# Altium project FIT_PM_Dual_Range_AFE.PrjPcb (part 6 of 8)

## Sheet ADCs.SchDoc: FIT_PM12 board
size 420 x 297 mm; CheckedBy: G.Kasprowicz; Author: INR Moscow; CompanyName: WUT ISE; DrawnBy: M.Podgórski; Organization: WUT ISE; Address1: PW ISE; Address2: Nowowiejska 15/19 00-665 Warsaw; Address3: gkasprow@gmail.com; DocumentNumber: 4; Revision: 2; SheetNumber: 6; SheetTotal: 21; ModifiedBy: -; CheckedDate: -; Title2: ADCs; DivGrp: WUT ISE; Designer: INR RAS; ModifiedDate: -; ProjectName: Sensor Box
Used 2 times, as channels U_AFE/U_ADCs1, U_AFE/U_ADCs2. Parts and nets are listed once, with the designators drawn on the sheet.
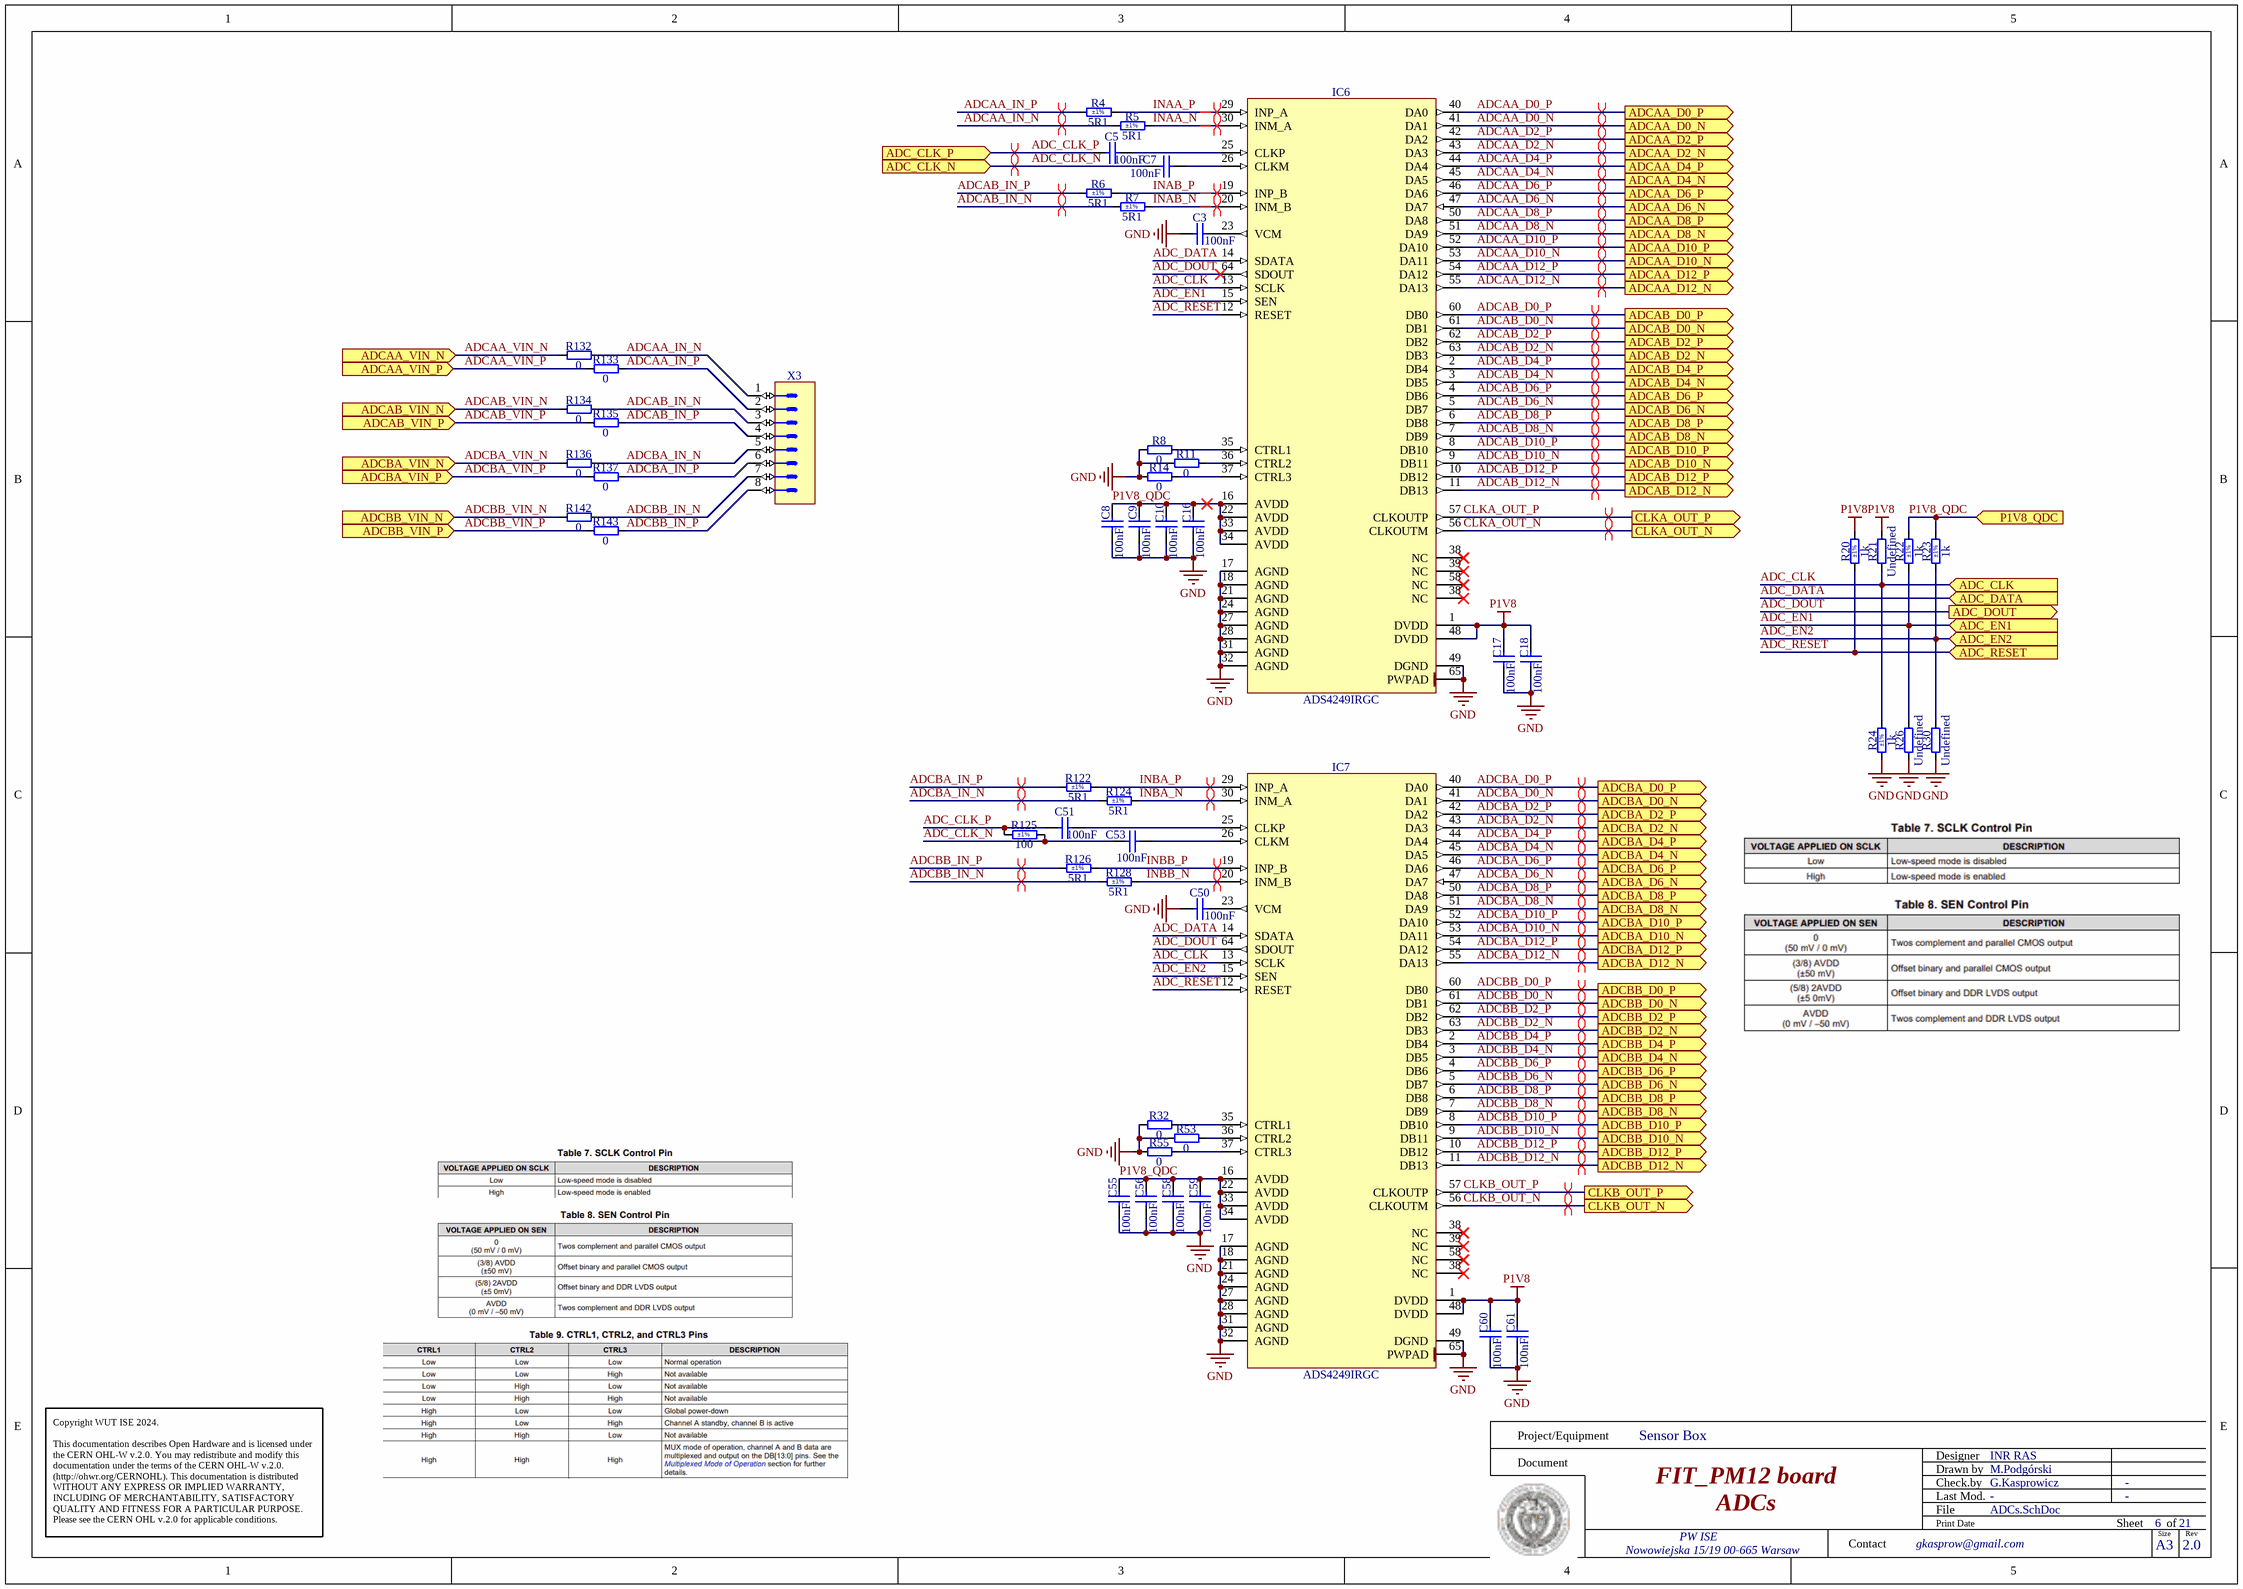
[diagram p17: ADCs.SchDoc]

### Parts
C3  100nF  [CAPC1005X55N]
C5  100nF  [CAPC1005X55N]
C7  100nF  [CAPC1005X55N]
C8  100nF  [CAPC1005X55N]
C9  100nF  [CAPC1005X55N]
C10  100nF  [CAPC1005X55N]
C16  100nF  [CAPC1005X55N]
C17  100nF  [CAPC1005X55N]
C18  100nF  [CAPC1005X55N]
C50  100nF  [CAPC1005X55N]
C51  100nF  [CAPC1005X55N]
C53  100nF  [CAPC1005X55N]
C55  100nF  [CAPC1005X55N]
C56  100nF  [CAPC1005X55N]
C58  100nF  [CAPC1005X55N]
C59  100nF  [CAPC1005X55N]
C60  100nF  [CAPC1005X55N]
C61  100nF  [CAPC1005X55N]
IC6  ADS4249IRGC  [QFN50P900X900X100-65N-S750]
IC7  ADS4249IRGC  [QFN50P900X900X100-65N-S750]
R4  5R1  Tolerance: ±1%  [RESC1005X40N]
R5  5R1  Tolerance: ±1%  [RESC1005X40N]
R6  5R1  Tolerance: ±1%  [RESC1005X40N]
R7  5R1  Tolerance: ±1%  [RESC1005X40N]
R8  0  [RESC1005X40N]
R11  0  [RESC1005X40N]
R14  0  [RESC1005X40N]
R20  1k  Tolerance: ±1%  [RESC1005X40N]
R21  Undefined  [RESC1005X40N]
R22  1k  Tolerance: ±1%  [RESC1005X40N]
R23  1k  Tolerance: ±1%  [RESC1005X40N]
R24  1k  Tolerance: ±1%  [RESC1005X40N]
R26  Undefined  [RESC1005X40N]
R30  Undefined  [RESC1005X40N]
R32  0  [RESC1005X40N]
R53  0  [RESC1005X40N]
R55  0  [RESC1005X40N]
R122  5R1  Tolerance: ±1%  [RESC1005X40N]
R124  5R1  Tolerance: ±1%  [RESC1005X40N]
R125  100  Tolerance: ±1%  [RESC1608X55N]
R126  5R1  Tolerance: ±1%  [RESC1005X40N]
R128  5R1  Tolerance: ±1%  [RESC1005X40N]
R132  0  [RESC1005X40N]
R133  0  [RESC1005X40N]
R134  0  [RESC1005X40N]
R135  0  [RESC1005X40N]
R136  0  [RESC1005X40N]
R137  0  [RESC1005X40N]
R142  0  [RESC1005X40N]
R143  0  [RESC1005X40N]
X3  Header 8  [SAMTEC_DW-08-09-L-S-470]  (value not drawn)

### Ports
ADC_CLK (in), ADC_CLK_N (in), ADC_CLK_P (in), ADC_DATA (in), ADC_DOUT (out), ADC_EN1 (in), ADC_EN2 (in), ADC_RESET (in), ADCAA_D0_N (out), ADCAA_D0_P (out), ADCAA_D2_N (out), ADCAA_D2_P (out), ADCAA_D4_N (out), ADCAA_D4_P (out), ADCAA_D6_N (out), ADCAA_D6_P (out), ADCAA_D8_N (out), ADCAA_D8_P (out), ADCAA_D10_N (out), ADCAA_D10_P (out), ADCAA_D12_N (out), ADCAA_D12_P (out), ADCAA_VIN_N (in), ADCAA_VIN_P (in), ADCAB_D0_N (out), ADCAB_D0_P (out), ADCAB_D2_N (out), ADCAB_D2_P (out), ADCAB_D4_N (out), ADCAB_D4_P (out), ADCAB_D6_N (out), ADCAB_D6_P (out), ADCAB_D8_N (out), ADCAB_D8_P (out), ADCAB_D10_N (out), ADCAB_D10_P (out), ADCAB_D12_N (out), ADCAB_D12_P (out), ADCAB_VIN_N (in), ADCAB_VIN_P (in), ADCBA_D0_N (out), ADCBA_D0_P (out), ADCBA_D2_N (out), ADCBA_D2_P (out), ADCBA_D4_N (out), ADCBA_D4_P (out), ADCBA_D6_N (out), ADCBA_D6_P (out), ADCBA_D8_N (out), ADCBA_D8_P (out), ADCBA_D10_N (out), ADCBA_D10_P (out), ADCBA_D12_N (out), ADCBA_D12_P (out), ADCBA_VIN_N (in), ADCBA_VIN_P (in), ADCBB_D0_N (out), ADCBB_D0_P (out), ADCBB_D2_N (out), ADCBB_D2_P (out), ADCBB_D4_N (out), ADCBB_D4_P (out), ADCBB_D6_N (out), ADCBB_D6_P (out), ADCBB_D8_N (out), ADCBB_D8_P (out), ADCBB_D10_N (out), ADCBB_D10_P (out), ADCBB_D12_N (out), ADCBB_D12_P (out), ADCBB_VIN_N (in), ADCBB_VIN_P (in), CLKA_OUT_N (out), CLKA_OUT_P (out), CLKB_OUT_N (out), CLKB_OUT_P (out), P1V8_QDC (in)

### Nets
GND: C3.1 C8.1 C9.1 C10.1 C16.1 C17.1 C18.1 C50.1 C55.1 C56.1 C58.1 C59.1 C60.1 C61.1 IC6.17(AGND) IC6.18(AGND) IC6.21(AGND) IC6.24(AGND) IC6.27(AGND) IC6.28(AGND) IC6.31(AGND) IC6.32(AGND) IC6.49(DGND) IC6.65(PWPAD) IC7.17(AGND) IC7.18(AGND) IC7.21(AGND) IC7.24(AGND) IC7.27(AGND) IC7.28(AGND) IC7.31(AGND) IC7.32(AGND) IC7.49(DGND) IC7.65(PWPAD) R8.1 R11.1 R14.1 R24.1 R26.1 R30.1 R32.1 R53.1 R55.1
P1V8: C17.2 C18.2 C60.2 C61.2 IC6.1(DVDD) IC6.48(DVDD) IC7.1(DVDD) IC7.48(DVDD) R20.2 R21.2
ADC_CLK: IC6.13(SCLK) IC7.13(SCLK) R21.1 R24.2 ; port ADC_CLK
ADC_CLK_N: C7.1 C53.1 R125.2 ; port ADC_CLK_N
ADC_CLK_P: C5.1 C51.1 R125.1 ; port ADC_CLK_P
ADC_DATA: IC6.14(SDATA) IC7.14(SDATA) ; port ADC_DATA
ADC_DOUT: IC6.64(SDOUT) IC7.64(SDOUT) ; port ADC_DOUT
ADC_EN1: IC6.15(SEN) R22.1 R26.2 ; port ADC_EN1
ADC_EN2: IC7.15(SEN) R23.1 R30.2 ; port ADC_EN2
ADC_RESET: IC6.12(RESET) IC7.12(RESET) R20.1 ; port ADC_RESET
ADCAA_D0_N: IC6.41(DA1) ; port ADCAA_D0_N
ADCAA_D0_P: IC6.40(DA0) ; port ADCAA_D0_P
ADCAA_D2_N: IC6.43(DA3) ; port ADCAA_D2_N
ADCAA_D2_P: IC6.42(DA2) ; port ADCAA_D2_P
ADCAA_D4_N: IC6.45(DA5) ; port ADCAA_D4_N
ADCAA_D4_P: IC6.44(DA4) ; port ADCAA_D4_P
ADCAA_D6_N: IC6.47(DA7) ; port ADCAA_D6_N
ADCAA_D6_P: IC6.46(DA6) ; port ADCAA_D6_P
ADCAA_D8_N: IC6.51(DA9) ; port ADCAA_D8_N
ADCAA_D8_P: IC6.50(DA8) ; port ADCAA_D8_P
ADCAA_D10_N: IC6.53(DA11) ; port ADCAA_D10_N
ADCAA_D10_P: IC6.52(DA10) ; port ADCAA_D10_P
ADCAA_D12_N: IC6.55(DA13) ; port ADCAA_D12_N
ADCAA_D12_P: IC6.54(DA12) ; port ADCAA_D12_P
ADCAA_IN_N: R5.1 R132.2 X3.1
ADCAA_IN_P: R4.1 R133.2 X3.2
ADCAA_VIN_N: R132.1 ; port ADCAA_VIN_N
ADCAA_VIN_P: R133.1 ; port ADCAA_VIN_P
ADCAB_D0_N: IC6.61(DB1) ; port ADCAB_D0_N
ADCAB_D0_P: IC6.60(DB0) ; port ADCAB_D0_P
ADCAB_D2_N: IC6.63(DB3) ; port ADCAB_D2_N
ADCAB_D2_P: IC6.62(DB2) ; port ADCAB_D2_P
ADCAB_D4_N: IC6.3(DB5) ; port ADCAB_D4_N
ADCAB_D4_P: IC6.2(DB4) ; port ADCAB_D4_P
ADCAB_D6_N: IC6.5(DB7) ; port ADCAB_D6_N
ADCAB_D6_P: IC6.4(DB6) ; port ADCAB_D6_P
ADCAB_D8_N: IC6.7(DB9) ; port ADCAB_D8_N
ADCAB_D8_P: IC6.6(DB8) ; port ADCAB_D8_P
ADCAB_D10_N: IC6.9(DB11) ; port ADCAB_D10_N
ADCAB_D10_P: IC6.8(DB10) ; port ADCAB_D10_P
ADCAB_D12_N: IC6.11(DB13) ; port ADCAB_D12_N
ADCAB_D12_P: IC6.10(DB12) ; port ADCAB_D12_P
ADCAB_IN_N: R7.1 R134.2 X3.3
ADCAB_IN_P: R6.1 R135.2 X3.4
ADCAB_VIN_N: R134.1 ; port ADCAB_VIN_N
ADCAB_VIN_P: R135.1 ; port ADCAB_VIN_P
ADCBA_D0_N: IC7.41(DA1) ; port ADCBA_D0_N
ADCBA_D0_P: IC7.40(DA0) ; port ADCBA_D0_P
ADCBA_D2_N: IC7.43(DA3) ; port ADCBA_D2_N
ADCBA_D2_P: IC7.42(DA2) ; port ADCBA_D2_P
ADCBA_D4_N: IC7.45(DA5) ; port ADCBA_D4_N
ADCBA_D4_P: IC7.44(DA4) ; port ADCBA_D4_P
ADCBA_D6_N: IC7.47(DA7) ; port ADCBA_D6_N
ADCBA_D6_P: IC7.46(DA6) ; port ADCBA_D6_P
ADCBA_D8_N: IC7.51(DA9) ; port ADCBA_D8_N
ADCBA_D8_P: IC7.50(DA8) ; port ADCBA_D8_P
ADCBA_D10_N: IC7.53(DA11) ; port ADCBA_D10_N
ADCBA_D10_P: IC7.52(DA10) ; port ADCBA_D10_P
ADCBA_D12_N: IC7.55(DA13) ; port ADCBA_D12_N
ADCBA_D12_P: IC7.54(DA12) ; port ADCBA_D12_P
ADCBA_IN_N: R124.1 R136.2 X3.5
ADCBA_IN_P: R122.1 R137.2 X3.6
ADCBA_VIN_N: R136.1 ; port ADCBA_VIN_N
ADCBA_VIN_P: R137.1 ; port ADCBA_VIN_P
ADCBB_D0_N: IC7.61(DB1) ; port ADCBB_D0_N
ADCBB_D0_P: IC7.60(DB0) ; port ADCBB_D0_P
ADCBB_D2_N: IC7.63(DB3) ; port ADCBB_D2_N
ADCBB_D2_P: IC7.62(DB2) ; port ADCBB_D2_P
ADCBB_D4_N: IC7.3(DB5) ; port ADCBB_D4_N
ADCBB_D4_P: IC7.2(DB4) ; port ADCBB_D4_P
ADCBB_D6_N: IC7.5(DB7) ; port ADCBB_D6_N
ADCBB_D6_P: IC7.4(DB6) ; port ADCBB_D6_P
ADCBB_D8_N: IC7.7(DB9) ; port ADCBB_D8_N
ADCBB_D8_P: IC7.6(DB8) ; port ADCBB_D8_P
ADCBB_D10_N: IC7.9(DB11) ; port ADCBB_D10_N
ADCBB_D10_P: IC7.8(DB10) ; port ADCBB_D10_P
ADCBB_D12_N: IC7.11(DB13) ; port ADCBB_D12_N
ADCBB_D12_P: IC7.10(DB12) ; port ADCBB_D12_P
ADCBB_IN_N: R128.1 R142.2 X3.7
ADCBB_IN_P: R126.1 R143.2 X3.8
ADCBB_VIN_N: R142.1 ; port ADCBB_VIN_N
ADCBB_VIN_P: R143.1 ; port ADCBB_VIN_P
CLKA_OUT_N: IC6.56(CLKOUTM) ; port CLKA_OUT_N
CLKA_OUT_P: IC6.57(CLKOUTP) ; port CLKA_OUT_P
CLKB_OUT_N: IC7.56(CLKOUTM) ; port CLKB_OUT_N
CLKB_OUT_P: IC7.57(CLKOUTP) ; port CLKB_OUT_P
INAA_N: IC6.30(INM_A) R5.2
INAA_P: IC6.29(INP_A) R4.2
INAB_N: IC6.20(INM_B) R7.2
INAB_P: IC6.19(INP_B) R6.2
INBA_N: IC7.30(INM_A) R124.2
INBA_P: IC7.29(INP_A) R122.2
INBB_N: IC7.20(INM_B) R128.2
INBB_P: IC7.19(INP_B) R126.2
P1V8_QDC: C8.2 C9.2 C10.2 C16.2 C55.2 C56.2 C58.2 C59.2 IC6.16(AVDD) IC6.22(AVDD) IC6.33(AVDD) IC6.34(AVDD) IC7.16(AVDD) IC7.22(AVDD) IC7.33(AVDD) IC7.34(AVDD) R22.2 R23.2 ; port P1V8_QDC
NetC3_2: C3.2 IC6.23(VCM)
NetC5_2: C5.2 IC6.25(CLKP)
NetC7_2: C7.2 IC6.26(CLKM)
NetC50_2: C50.2 IC7.23(VCM)
NetC51_2: C51.2 IC7.25(CLKP)
NetC53_2: C53.2 IC7.26(CLKM)
NetIC6_35: IC6.35(CTRL1) R8.2
NetIC6_36: IC6.36(CTRL2) R11.2
NetIC6_37: IC6.37(CTRL3) R14.2
NetIC7_35: IC7.35(CTRL1) R32.2
NetIC7_36: IC7.36(CTRL2) R53.2
NetIC7_37: IC7.37(CTRL3) R55.2

Not connected (* = marked no-connect by the designer): IC6 38(NC)* 39(NC)* 58(NC)*; IC7 38(NC)* 39(NC)* 58(NC)*

### Channels
U_AFE/U_ADCs1: designators C3=C3A C5=C5A C7=C7A C8=C8A C9=C9A C10=C10A C16=C16A C17=C17A C18=C18A C50=C50A C51=C51A C53=C53A C55=C55A C56=C56A C58=C58A C59=C59A C60=C60A C61=C61A IC6=IC6A IC7=IC7A R4=R4A R5=R5A R6=R6A R7=R7A R8=R8A R11=R15A R14=R14A R20=R20A R21=R21A R22=R22A R23=R23A R24=R24A R26=R26A R30=R30A R32=R32A R53=R53A R55=R55A R122=R122A R124=R124A R125=R125A R126=R126A R128=R128A R132=R132A R133=R133A R134=R134A R135=R135A R136=R136A R137=R137A R142=R142A R143=R143A X3=X3A; ports ADC_CLK=ADC_CLK_U_ADCs1 ADC_CLK_N=ADC_CLK_N ADC_CLK_P=ADC_CLK_P ADC_DATA=ADC_DATA_U_ADCs1 ADC_DOUT=ADC_DOUT_U_ADCs1 ADC_EN1=ADC_EN1_U_ADCs1 ADC_EN2=ADC_EN2_U_ADCs1 ADC_RESET=ADC_RESET_U_ADCs1 ADCAA_D0_N=ADCAA_D0_N_U_ADCs1 ADCAA_D0_P=ADCAA_D0_P_U_ADCs1 ADCAA_D2_N=ADCAA_D2_N_U_ADCs1 ADCAA_D2_P=ADCAA_D2_P_U_ADCs1 ADCAA_D4_N=ADCAA_D4_N_U_ADCs1 ADCAA_D4_P=ADCAA_D4_P_U_ADCs1 ADCAA_D6_N=ADCAA_D6_N_U_ADCs1 ADCAA_D6_P=ADCAA_D6_P_U_ADCs1 ADCAA_D8_N=ADCAA_D8_N_U_ADCs1 ADCAA_D8_P=ADCAA_D8_P_U_ADCs1 ADCAA_D10_N=ADCAA_D10_N_U_ADCs1 ADCAA_D10_P=ADCAA_D10_P_U_ADCs1 ADCAA_D12_N=ADCAA_D12_N_U_ADCs1 ADCAA_D12_P=ADCAA_D12_P_U_ADCs1 ADCAA_VIN_N=ADCAA_VIN_N ADCAA_VIN_P=ADCAA_VIN_P ADCAB_D0_N=ADCAB_D0_N_U_ADCs1 ADCAB_D0_P=ADCAB_D0_P_U_ADCs1 ADCAB_D2_N=ADCAB_D2_N_U_ADCs1 ADCAB_D2_P=ADCAB_D2_P_U_ADCs1 ADCAB_D4_N=ADCAB_D4_N_U_ADCs1 ADCAB_D4_P=ADCAB_D4_P_U_ADCs1 ADCAB_D6_N=ADCAB_D6_N_U_ADCs1 ADCAB_D6_P=ADCAB_D6_P_U_ADCs1 ADCAB_D8_N=ADCAB_D8_N_U_ADCs1 ADCAB_D8_P=ADCAB_D8_P_U_ADCs1 ADCAB_D10_N=ADCAB_D10_N_U_ADCs1 ADCAB_D10_P=ADCAB_D10_P_U_ADCs1 ADCAB_D12_N=ADCAB_D12_N_U_ADCs1 ADCAB_D12_P=ADCAB_D12_P_U_ADCs1 ADCAB_VIN_N=ADCAB_VIN_N ADCAB_VIN_P=ADCAB_VIN_P ADCBA_D0_N=ADCBA_D0_N_U_ADCs1 ADCBA_D0_P=ADCBA_D0_P_U_ADCs1 ADCBA_D2_N=ADCBA_D2_N_U_ADCs1 ADCBA_D2_P=ADCBA_D2_P_U_ADCs1 ADCBA_D4_N=ADCBA_D4_N_U_ADCs1 ADCBA_D4_P=ADCBA_D4_P_U_ADCs1 ADCBA_D6_N=ADCBA_D6_N_U_ADCs1 ADCBA_D6_P=ADCBA_D6_P_U_ADCs1 ADCBA_D8_N=ADCBA_D8_N_U_ADCs1 ADCBA_D8_P=ADCBA_D8_P_U_ADCs1 ADCBA_D10_N=ADCBA_D10_N_U_ADCs1 ADCBA_D10_P=ADCBA_D10_P_U_ADCs1 ADCBA_D12_N=ADCBA_D12_N_U_ADCs1 ADCBA_D12_P=ADCBA_D12_P_U_ADCs1 ADCBA_VIN_N=ADCBA_VIN_N ADCBA_VIN_P=ADCBA_VIN_P ADCBB_D0_N=ADCBB_D0_N_U_ADCs1 ADCBB_D0_P=ADCBB_D0_P_U_ADCs1 ADCBB_D2_N=ADCBB_D2_N_U_ADCs1 ADCBB_D2_P=ADCBB_D2_P_U_ADCs1 ADCBB_D4_N=ADCBB_D4_N_U_ADCs1 ADCBB_D4_P=ADCBB_D4_P_U_ADCs1 ADCBB_D6_N=ADCBB_D6_N_U_ADCs1 ADCBB_D6_P=ADCBB_D6_P_U_ADCs1 ADCBB_D8_N=ADCBB_D8_N_U_ADCs1 ADCBB_D8_P=ADCBB_D8_P_U_ADCs1 ADCBB_D10_N=ADCBB_D10_N_U_ADCs1 ADCBB_D10_P=ADCBB_D10_P_U_ADCs1 ADCBB_D12_N=ADCBB_D12_N_U_ADCs1 ADCBB_D12_P=ADCBB_D12_P_U_ADCs1 ADCBB_VIN_N=ADCBB_VIN_N ADCBB_VIN_P=ADCBB_VIN_P CLKA_OUT_N=CLKA_OUT_N_U_ADCs1 CLKA_OUT_P=CLKA_OUT_P_U_ADCs1 CLKB_OUT_N=CLKB_OUT_N_U_ADCs1 CLKB_OUT_P=CLKB_OUT_P_U_ADCs1 P1V8_QDC=P1V8_QDC
U_AFE/U_ADCs2: designators C3=C3B C5=C5B C7=C7B C8=C8B C9=C9B C10=C10B C16=C16B C17=C17B C18=C18B C50=C50B C51=C51B C53=C53B C55=C55B C56=C56B C58=C58B C59=C59B C60=C60B C61=C61B IC6=IC6B IC7=IC7B R4=R4B R5=R5B R6=R6B R7=R7B R8=R8B R11=R15B R14=R14B R20=R20B R21=R21B R22=R22B R23=R23B R24=R24B R26=R26B R30=R30B R32=R32B R53=R53B R55=R55B R122=R122B R124=R124B R125=R125B R126=R126B R128=R128B R132=R132B R133=R133B R134=R134B R135=R135B R136=R136B R137=R137B R142=R142B R143=R143B X3=X3B; ports ADC_CLK=ADC_CLK_U_ADCs2 ADC_CLK_N=ADC_CLK_N ADC_CLK_P=ADC_CLK_P ADC_DATA=ADC_DATA_U_ADCs2 ADC_DOUT=ADC_DOUT_U_ADCs2 ADC_EN1=ADC_EN1_U_ADCs2 ADC_EN2=ADC_EN2_U_ADCs2 ADC_RESET=ADC_RESET_U_ADCs2 ADCAA_D0_N=ADCAA_D0_N_U_ADCs2 ADCAA_D0_P=ADCAA_D0_P_U_ADCs2 ADCAA_D2_N=ADCAA_D2_N_U_ADCs2 ADCAA_D2_P=ADCAA_D2_P_U_ADCs2 ADCAA_D4_N=ADCAA_D4_N_U_ADCs2 ADCAA_D4_P=ADCAA_D4_P_U_ADCs2 ADCAA_D6_N=ADCAA_D6_N_U_ADCs2 ADCAA_D6_P=ADCAA_D6_P_U_ADCs2 ADCAA_D8_N=ADCAA_D8_N_U_ADCs2 ADCAA_D8_P=ADCAA_D8_P_U_ADCs2 ADCAA_D10_N=ADCAA_D10_N_U_ADCs2 ADCAA_D10_P=ADCAA_D10_P_U_ADCs2 ADCAA_D12_N=ADCAA_D12_N_U_ADCs2 ADCAA_D12_P=ADCAA_D12_P_U_ADCs2 ADCAA_VIN_N=ADCAA_VIN_N ADCAA_VIN_P=ADCAA_VIN_P ADCAB_D0_N=ADCAB_D0_N_U_ADCs2 ADCAB_D0_P=ADCAB_D0_P_U_ADCs2 ADCAB_D2_N=ADCAB_D2_N_U_ADCs2 ADCAB_D2_P=ADCAB_D2_P_U_ADCs2 ADCAB_D4_N=ADCAB_D4_N_U_ADCs2 ADCAB_D4_P=ADCAB_D4_P_U_ADCs2 ADCAB_D6_N=ADCAB_D6_N_U_ADCs2 ADCAB_D6_P=ADCAB_D6_P_U_ADCs2 ADCAB_D8_N=ADCAB_D8_N_U_ADCs2 ADCAB_D8_P=ADCAB_D8_P_U_ADCs2 ADCAB_D10_N=ADCAB_D10_N_U_ADCs2 ADCAB_D10_P=ADCAB_D10_P_U_ADCs2 ADCAB_D12_N=ADCAB_D12_N_U_ADCs2 ADCAB_D12_P=ADCAB_D12_P_U_ADCs2 ADCAB_VIN_N=ADCAB_VIN_N ADCAB_VIN_P=ADCAB_VIN_P ADCBA_D0_N=ADCBA_D0_N_U_ADCs2 ADCBA_D0_P=ADCBA_D0_P_U_ADCs2 ADCBA_D2_N=ADCBA_D2_N_U_ADCs2 ADCBA_D2_P=ADCBA_D2_P_U_ADCs2 ADCBA_D4_N=ADCBA_D4_N_U_ADCs2 ADCBA_D4_P=ADCBA_D4_P_U_ADCs2 ADCBA_D6_N=ADCBA_D6_N_U_ADCs2 ADCBA_D6_P=ADCBA_D6_P_U_ADCs2 ADCBA_D8_N=ADCBA_D8_N_U_ADCs2 ADCBA_D8_P=ADCBA_D8_P_U_ADCs2 ADCBA_D10_N=ADCBA_D10_N_U_ADCs2 ADCBA_D10_P=ADCBA_D10_P_U_ADCs2 ADCBA_D12_N=ADCBA_D12_N_U_ADCs2 ADCBA_D12_P=ADCBA_D12_P_U_ADCs2 ADCBA_VIN_N=ADCBA_VIN_N ADCBA_VIN_P=ADCBA_VIN_P ADCBB_D0_N=ADCBB_D0_N_U_ADCs2 ADCBB_D0_P=ADCBB_D0_P_U_ADCs2 ADCBB_D2_N=ADCBB_D2_N_U_ADCs2 ADCBB_D2_P=ADCBB_D2_P_U_ADCs2 ADCBB_D4_N=ADCBB_D4_N_U_ADCs2 ADCBB_D4_P=ADCBB_D4_P_U_ADCs2 ADCBB_D6_N=ADCBB_D6_N_U_ADCs2 ADCBB_D6_P=ADCBB_D6_P_U_ADCs2 ADCBB_D8_N=ADCBB_D8_N_U_ADCs2 ADCBB_D8_P=ADCBB_D8_P_U_ADCs2 ADCBB_D10_N=ADCBB_D10_N_U_ADCs2 ADCBB_D10_P=ADCBB_D10_P_U_ADCs2 ADCBB_D12_N=ADCBB_D12_N_U_ADCs2 ADCBB_D12_P=ADCBB_D12_P_U_ADCs2 ADCBB_VIN_N=ADCBB_VIN_N ADCBB_VIN_P=ADCBB_VIN_P CLKA_OUT_N=CLKA_OUT_N_U_ADCs2 CLKA_OUT_P=CLKA_OUT_P_U_ADCs2 CLKB_OUT_N=CLKB_OUT_N_U_ADCs2 CLKB_OUT_P=CLKB_OUT_P_U_ADCs2 P1V8_QDC=P1V8_QDC

### Layout directives
differential pair; differential pair class D100: ADC_CLK_N, ADC_CLK_P, ADCAA_D0_N_U_ADCs1, ADCAA_D0_P_U_ADCs1, ADCAA_D2_N_U_ADCs1, ADCAA_D2_P_U_ADCs1, ADCAA_D4_N_U_ADCs1, ADCAA_D4_P_U_ADCs1, ADCAA_D6_N_U_ADCs1, ADCAA_D6_P_U_ADCs1, ADCAA_D8_N_U_ADCs1, ADCAA_D8_P_U_ADCs1, ADCAA_D10_N_U_ADCs1, ADCAA_D10_P_U_ADCs1, ADCAA_D12_N_U_ADCs1, ADCAA_D12_P_U_ADCs1, ADCAA_IN_N_U_ADCs1, ADCAA_IN_P_U_ADCs1, ADCAB_D0_N_U_ADCs1, ADCAB_D0_P_U_ADCs1, ADCAB_D2_N_U_ADCs1, ADCAB_D2_P_U_ADCs1, ADCAB_D4_N_U_ADCs1, ADCAB_D4_P_U_ADCs1, ADCAB_D6_N_U_ADCs1, ADCAB_D6_P_U_ADCs1, ADCAB_D8_N_U_ADCs1, ADCAB_D8_P_U_ADCs1, ADCAB_D10_N_U_ADCs1, ADCAB_D10_P_U_ADCs1, ADCAB_D12_N_U_ADCs1, ADCAB_D12_P_U_ADCs1, ADCAB_IN_N_U_ADCs1, ADCAB_IN_P_U_ADCs1, ADCBA_D0_N_U_ADCs1, ADCBA_D0_P_U_ADCs1, ADCBA_D2_N_U_ADCs1, ADCBA_D2_P_U_ADCs1, ADCBA_D4_N_U_ADCs1, ADCBA_D4_P_U_ADCs1, ADCBA_D6_N_U_ADCs1, ADCBA_D6_P_U_ADCs1, ADCBA_D8_N_U_ADCs1, ADCBA_D8_P_U_ADCs1, ADCBA_D10_N_U_ADCs1, ADCBA_D10_P_U_ADCs1, ADCBA_D12_N_U_ADCs1, ADCBA_D12_P_U_ADCs1, ADCBA_IN_N_U_ADCs1, ADCBA_IN_P_U_ADCs1, ADCBB_D0_N_U_ADCs1, ADCBB_D0_P_U_ADCs1, ADCBB_D2_N_U_ADCs1, ADCBB_D2_P_U_ADCs1, ADCBB_D4_N_U_ADCs1, ADCBB_D4_P_U_ADCs1, ADCBB_D6_N_U_ADCs1, ADCBB_D6_P_U_ADCs1, ADCBB_D8_N_U_ADCs1, ADCBB_D8_P_U_ADCs1, ADCBB_D10_N_U_ADCs1, ADCBB_D10_P_U_ADCs1, ADCBB_D12_N_U_ADCs1, ADCBB_D12_P_U_ADCs1, ADCBB_IN_N_U_ADCs1, ADCBB_IN_P_U_ADCs1, CLKA_OUT_N_U_ADCs1, CLKA_OUT_P_U_ADCs1, CLKB_OUT_N_U_ADCs1, CLKB_OUT_P_U_ADCs1, INAA_N_U_ADCs1, INAA_P_U_ADCs1, INAB_N_U_ADCs1, INAB_P_U_ADCs1, INBA_N_U_ADCs1, INBA_P_U_ADCs1, INBB_N_U_ADCs1, INBB_P_U_ADCs1

### Notes on the sheet
- Project/Equipment
- Document
- Designer
- Drawn by
- Check.by
- Copyright WUT ISE 2024.
  This documentation describes Open Hardware and is licensed under the CERN OHL-W v.2.0. You may redistribute and modify this documentation under the terms of the CERN OHL-W v.2.0. (http://ohwr.org/CERNOHL). This documentation is distributed WITHOUT ANY EXPRESS OR IMPLIED WARRANTY, INCLUDING OF MERCHANTABILITY, SATISFACTORY QUALITY AND FITNESS FOR A PARTICULAR PURPOSE. Please see the CERN OHL v.2.0 for applicable conditions.
- Contact
- File
- Last Mod.
- Print Date
- Sheet
- Size
- A3
- of
- Rev

### Library data of the parts
C3 C5 C7-C10 C16-C18 C50 C51 C53 C55 C56 C58-C61 = CC0402_100NF_16V_10%_X5R: Non-polarised capacitor; Part Description: SMD Multilayer Chip Ceramic Capacitor; Manufacturer: GENERIC; Manufacturer1 Part Number: GRM155R61C104KA88D; Voltage: 16V; TC: X5R; Tolerance: ±10%; Part Number: CC0402_100NF_16V_10%_X5R; Component Kind: Standard; Component Type: Standard; Pin Count: 2; Value: 100nF; Status: None; Manufacturer Part Number: CC0402_100NF_16V_10%_X5R; Case: 0402; Mounted: Yes; Socket: No; SMD: Yes; Sense: No; Manufacturer1 Example: MURATA; Manufacturer1 ComponentHeight: 0.55mm; HelpURL: \\cern.ch\dfs\Applications\Altium\Datasheets\CC0402_X5R_MURATA_GRM.pdf; Author: CERN DEM JLC; CreateDate: 10.12.2013; LatestRevisionDate: 10.12.2013
IC6 IC7 = ADS4249IRGC: 16-Bit, 200-MSPS Analog-to-Digital Converters; Part Description: Dual-Channel, 14-Bit, 250-MSPS Ultralow-Power ADC; Manufacturer: TEXAS INSTRUMENTS; PressFit: No; Bonding: No; Part Number: ADS4249IRGC; Component Kind: Standard; Component Type: Standard; Device: ADS4249IRGC; PackageDescription: QFN, 0.50mm Pitch, Square; 64 Pin, 9.00mm L X 9.00mm W X 1.00mm H body (w/Thermal Tab 7.5 X 7.5mm), IPC Medium Density; Manufacturer Part Number: ADS4249IRGC; Pin Count: 65; Case: QFN64; Mounted: Yes; Socket: No; SMD: Yes; Sense: No; ComponentHeight: 1mm; Author: CERN DEM HF; HelpURL: \\cern.ch\dfs\Applications\Altium\Datasheets\ADS4249IRGC.pdf; CreateDate: 05.12.2024; LatestRevisionDate: 05.12.2024
R4-R7 R122 R124 R126 R128 = R0402_5R1_1%_0.0625W_100PPM: Resistor - 1%; Part Description: General Purpose Thick Film Chip Resistor; Manufacturer: GENERIC; Manufacturer1 Part Number: CRCW04025R10FK; TC: ±100ppm/°C; PressFit: No; Part Number: R0402_5R1_1%_0.0625W_100PPM; Component Kind: Standard; Component Type: Standard; Pin Count: 2; Value: 5R1; Status: Not Recommended; Power: 0.0625W; Manufacturer Part Number: R0402_5R1_1%_0.0625W_100PPM; Case: 0402; Mounted: Yes; Sense: No; Socket: No; SMD: Yes; Manufacturer1 Example: VISHAY; Manufacturer1 ComponentHeight: 0.4mm; HelpURL: \\cern.ch\dfs\Applications\Altium\Datasheets\R0402_VISHAY_CRCW e3.pdf; Author: CERN DEM MR; CreateDate: 22.11.2016; LatestRevisionDate: 22.11.2016
R8 R11 R14 R32 R53 R55 R132-R137 R142 R143 = R0402_0R_JUMPER: Resistor; Part Description: 1A (0.05R Max DC Resistance) Zero Ohm Jumper; Manufacturer: GENERIC; Manufacturer1 Part Number: 232270591001L; PressFit: No; Part Number: R0402_0R_JUMPER; Component Kind: Standard; Component Type: Standard; Pin Count: 2; Value: 0; Status: Not Recommended; Manufacturer Part Number: R0402_0R_JUMPER; Case: 0402; Mounted: Yes; Sense: No; Socket: No; SMD: Yes; Manufacturer1 Example: YAGEO PHYCOMP; Manufacturer1 ComponentHeight: 0.4mm; HelpURL: \\cern.ch\dfs\Applications\Altium\Datasheets\R0402_Phycomp_RC0402.pdf; Author: CERN DEM JLC; CreateDate: 03.12.2007; LatestRevisionDate: 17.10.2012
R20 R22-R24 = R0402_1K_1%_0.0625W_100PPM: Resistor - 1%; Part Description: General Purpose Thick Film Chip Resistor; Manufacturer: GENERIC; Manufacturer1 Part Number: 232270671002L; TC: ±100ppm/°C; PressFit: No; Part Number: R0402_1K_1%_0.0625W_100PPM; Component Kind: Standard; Component Type: Standard; Pin Count: 2; Value: 1k; Status: Not Recommended; Power: 0.0625W; Manufacturer Part Number: R0402_1K_1%_0.0625W_100PPM; Case: 0402; Mounted: Yes; Sense: No; Socket: No; SMD: Yes; Manufacturer1 Example: YAGEO PHYCOMP; Manufacturer1 ComponentHeight: 0.4mm; HelpURL: \\cern.ch\dfs\Applications\Altium\Datasheets\R0402_Phycomp_RC0402.pdf; Author: CERN DEM JLC; CreateDate: 03.12.2007; LatestRevisionDate: 17.10.2012
R21 R26 R30 = R0402_NO-VALUE: Resistor; Part Description: Reserved Footprint For a 0402 (1005) Chip Resistor; PressFit: No; Mounted: No; Part Number: R0402_NO-VALUE; Component Kind: Standard; Component Type: Standard; Pin Count: 2; Value: Undefined; Status: None; Manufacturer: Undefined; Manufacturer Part Number: R0402_NO-VALUE; Case: 0402; Sense: No; Socket: No; SMD: Yes; Manufacturer1 Example: Undefined; Manufacturer1 Part Number: Undefined; Manufacturer1 ComponentHeight: Undefined; HelpURL: Undefined; Author: CERN DEM JLC; CreateDate: 03.12.2007; LatestRevisionDate: 13.03.2008
R125 = R0603_100R_1%_0.1W_100PPM: Resistor - 1%; Part Description: General Purpose Thick Film Chip Resistor; Manufacturer: GENERIC; Manufacturer1 Part Number: NRC06F4700TRF; Power: 0.1W; TC: ±100ppm/°C; PressFit: No; Part Number: R0603_100R_1%_0.1W_100PPM; Component Kind: Standard; Component Type: Standard; Pin Count: 2; Value: 100; Status: Preferred; Manufacturer Part Number: R0603_100R_1%_0.1W_100PPM; Case: 0603; Mounted: Yes; Sense: No; Socket: No; SMD: Yes; Manufacturer1 Example: NIC COMPONENT; Manufacturer1 ComponentHeight: 0.55mm; HelpURL: \\cern.ch\dfs\Applications\Altium\Datasheets\R0603_NIC_NRC.pdf; Author: CERN DEM JLC; CreateDate: 03.12.2007; LatestRevisionDate: 13.03.2008
X3 = SAMTEC_DW-08-09-L-S-470: as X4 on sheet Gate_Strobe; Part Number: SAMTEC_DW-08-09-L-S-470; Component Kind: Standard; Component Type: Standard; Pin Count: 8; Family: Header 8; Mounted: Yes; Socket: No; SMD: No; Sense: No; Status: None; Manufacturer Part Number: DW-08-09-L-S-470; ComponentHeight: 15.75mm; HelpURL: \\cern.ch\dfs\Applications\Altium\Datasheets\SAMTEC_DW.pdf; Author: CERN DEM HF; CreateDate: 06.06.2024; LatestRevisionDate: 06.06.2024

## Sheet PM12_ATxmega128.SchDoc: FIT_PM12 board
size 420 x 297 mm; CheckedBy: G.Kasprowicz; Author: INR Moscow; CompanyName: WUT ISE; DrawnBy: M.Podgórski; Organization: WUT ISE; Address1: PW ISE; Address2: Nowowiejska 15/19 00-665 Warsaw; Address3: gkasprow@gmail.com; DocumentNumber: 21; Revision: 2; SheetNumber: 21; SheetTotal: 21; ModifiedBy: -; CheckedDate: -; Title2: MCU; DivGrp: WUT ISE; Designer: INR RAS; ModifiedDate: -; ProjectName: Sensor Box
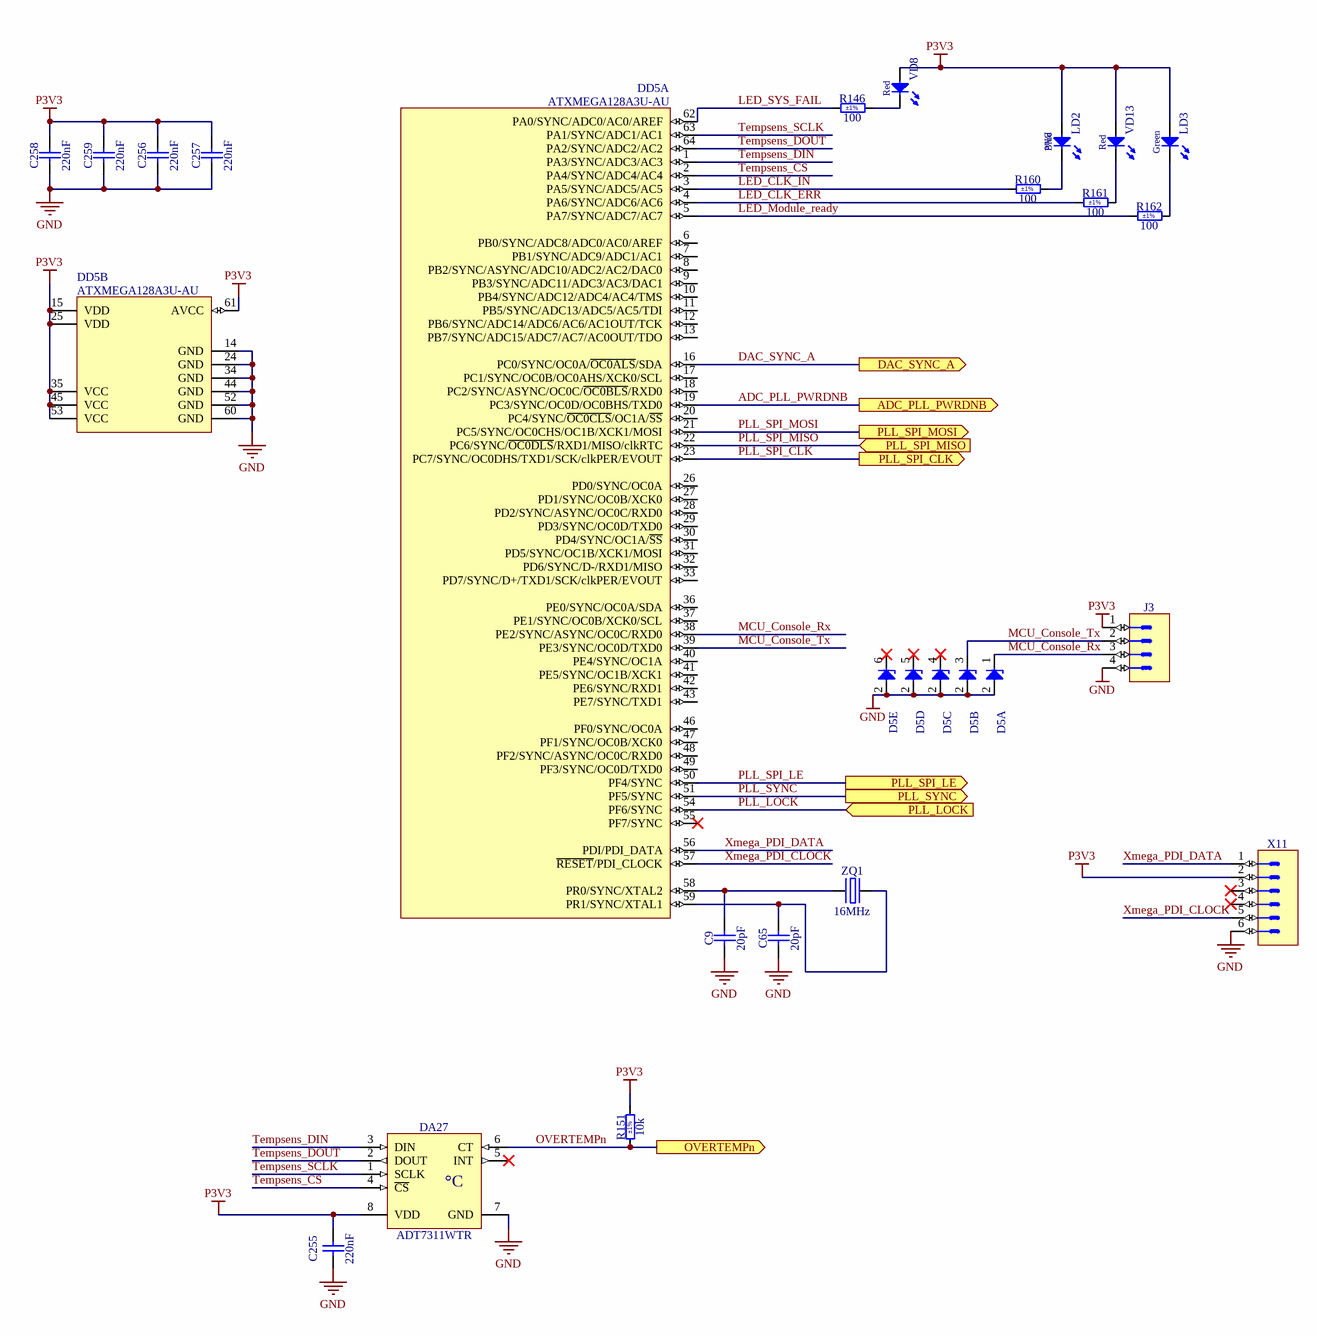
[diagram p18: PM12_ATxmega128.SchDoc]

### Parts
C9  20pF  [CAPC2012X135N]
C65  20pF  [CAPC2012X135N]
C255  220nF  [CAPC2012X135N]
C256  220nF  [CAPC2012X135N]
C257  220nF  [CAPC2012X135N]
C258  220nF  [CAPC2012X135N]
C259  220nF  [CAPC2012X135N]
D5  PESD3V3L5UY  [SOT65P210X110-6N]  (value not drawn)  (parts A,B,C,D,E of 5)
DA27  ADT7311WTR  [SOIC127P600X175-8N]
DD5  ATXMEGA128A3U-AU  [QFP80P1600X1600X120-64N]  (parts A,B of 2)
J3  Header 4  [SAMTEC_TSW-104-07-L-S-LL]  (value not drawn)
LD2  Blue  [LED_OSRAM_LB Q39G]
LD3  Green  [LED_KINGBRIGHT_KPH-1608CGCK]
R146  100  Tolerance: ±1%  [RESC1608X55N]
R151  10k  Tolerance: ±1%  [RESC1608X55N]
R160  100  Tolerance: ±1%  [RESC1608X55N]
R161  100  Tolerance: ±1%  [RESC1608X55N]
R162  100  Tolerance: ±1%  [RESC1608X55N]
VD8  Red  [LED_KINGBRIGHT_KPT-2012SURCK]
VD13  Red  [LED_KINGBRIGHT_KPT-2012SURCK]
X11  (no value)  [CONNFLY_DS1013-06SSIB1-B-0]
ZQ1  16MHz  [XTAL_ABRACON_ABL]

### Ports
ADC_PLL_PWRDNB (out), DAC_SYNC_A (out), OVERTEMPn (out), PLL_LOCK (in), PLL_SPI_CLK (out), PLL_SPI_LE (out), PLL_SPI_MISO (in), PLL_SPI_MOSI (out), PLL_SYNC (out)

### Nets
GND: C9.1 C65.1 C255.1 C256.1 C257.1 C258.1 C259.1 D5.2(A) DA27.7(GND) DD5.14(GND) DD5.24(GND) DD5.34(GND) DD5.44(GND) DD5.52(GND) DD5.60(GND) J3.4 X11.6
P3V3: C255.2 C256.2 C257.2 C258.2 C259.2 DA27.8(VDD) DD5.15(VDD) DD5.25(VDD) DD5.35(VCC) DD5.45(VCC) DD5.53(VCC) DD5.61(AVCC) J3.1 LD2.2(A) LD3.2(A) R151.2 VD8.2(A) VD13.2(A) X11.2
ADC_PLL_PWRDNB: DD5.19(PC3/SYNC/OC0D/OC0BHS/TXD0) ; port ADC_PLL_PWRDNB
DAC_SYNC_A: DD5.16(PC0/SYNC/OC0A/~{OC0ALS}/SDA) ; port DAC_SYNC_A  [project net DAC_SYNC]
LED_CLK_ERR: DD5.4(PA6/SYNC/ADC6/AC6) R161.1
LED_CLK_IN: DD5.3(PA5/SYNC/ADC5/AC5) R160.1
LED_Module_ready: DD5.5(PA7/SYNC/ADC7/AC7) R162.1
LED_SYS_FAIL: DD5.62(PA0/SYNC/ADC0/AC0/AREF) R146.1
MCU_Console_Rx: D5.1(C) DD5.38(PE2/SYNC/ASYNC/OC0C/RXD0) J3.3
MCU_Console_Tx: D5.3(C) DD5.39(PE3/SYNC/OC0D/TXD0) J3.2
OVERTEMPn: DA27.6(CT) R151.1 ; port OVERTEMPn
PLL_LOCK: DD5.54(PF6/SYNC) ; port PLL_LOCK
PLL_SPI_CLK: DD5.23(PC7/SYNC/OC0DHS/TXD1/SCK/clkPER/EVOUT) ; port PLL_SPI_CLK
PLL_SPI_LE: DD5.50(PF4/SYNC) ; port PLL_SPI_LE
PLL_SPI_MISO: DD5.22(PC6/SYNC/~{OC0DLS}/RXD1/MISO/clkRTC) ; port PLL_SPI_MISO
PLL_SPI_MOSI: DD5.21(PC5/SYNC/OC0CHS/OC1B/XCK1/MOSI) ; port PLL_SPI_MOSI
PLL_SYNC: DD5.51(PF5/SYNC) ; port PLL_SYNC
Tempsens_CS: DA27.4(~{CS}) DD5.2(PA4/SYNC/ADC4/AC4)
Tempsens_DIN: DA27.3(DIN) DD5.1(PA3/SYNC/ADC3/AC3)
Tempsens_DOUT: DA27.2(DOUT) DD5.64(PA2/SYNC/ADC2/AC2)
Tempsens_SCLK: DA27.1(SCLK) DD5.63(PA1/SYNC/ADC1/AC1)
Xmega_PDI_CLOCK: DD5.57(~{RESET}/PDI_CLOCK) X11.5
Xmega_PDI_DATA: DD5.56(PDI/PDI_DATA) X11.1
NetC9_2: C9.2 DD5.58(PR0/SYNC/XTAL2) ZQ1.1(OSC1)
NetC65_2: C65.2 DD5.59(PR1/SYNC/XTAL1) ZQ1.2(OSC2)
NetLD2_1: LD2.1(C) R160.2
NetLD3_1: LD3.1(C) R162.2
NetR146_2: R146.2 VD8.1(C)
NetR161_2: R161.2 VD13.1(C)

Not connected (* = marked no-connect by the designer): D5 4(C)* 5(C)* 6(C)*; DA27 5(INT)*; DD5 6(PB0/SYNC/ADC8/ADC0/AC0/AREF) 7(PB1/SYNC/ADC9/ADC1/AC1) 8(PB2/SYNC/ASYNC/ADC10/ADC2/AC2/DAC0) 9(PB3/SYNC/ADC11/ADC3/AC3/DAC1) 10(PB4/SYNC/ADC12/ADC4/AC4/TMS) 11(PB5/SYNC/ADC13/ADC5/AC5/TDI) 12(PB6/SYNC/ADC14/ADC6/AC6/AC1OUT/TCK) 13(PB7/SYNC/ADC15/ADC7/AC7/AC0OUT/TDO) 17(PC1/SYNC/OC0B/OC0AHS/XCK0/SCL) 18(PC2/SYNC/ASYNC/OC0C/~{OC0BLS}/RXD0) 20(PC4/SYNC/~{OC0CLS}/OC1A/~{SS}) 26(PD0/SYNC/OC0A) 27(PD1/SYNC/OC0B/XCK0) 28(PD2/SYNC/ASYNC/OC0C/RXD0) 29(PD3/SYNC/OC0D/TXD0) 30(PD4/SYNC/OC1A/~{SS}) 31(PD5/SYNC/OC1B/XCK1/MOSI) 32(PD6/SYNC/D-/RXD1/MISO) 33(PD7/SYNC/D+/TXD1/SCK/clkPER/EVOUT) 36(PE0/SYNC/OC0A/SDA) 37(PE1/SYNC/OC0B/XCK0/SCL) 40(PE4/SYNC/OC1A) 41(PE5/SYNC/OC1B/XCK1) 42(PE6/SYNC/RXD1) 43(PE7/SYNC/TXD1) 46(PF0/SYNC/OC0A) 47(PF1/SYNC/OC0B/XCK0) 48(PF2/SYNC/ASYNC/OC0C/RXD0) 49(PF3/SYNC/OC0D/TXD0) 55(PF7/SYNC)*; X11 3* 4*

### Notes on the sheet
- Project/Equipment
- Document
- Designer
- Drawn by
- Check.by
- Copyright WUT ISE 2024.
  This documentation describes Open Hardware and is licensed under the CERN OHL v.2. You may redistribute and modify this documentation under the terms of the CERN OHL v.2. (http://ohwr.org/CERNOHL). This documentation is distributed WITHOUT ANY EXPRESS OR IMPLIED WARRANTY, INCLUDING OF MERCHANTABILITY, SATISFACTORY QUALITY AND FITNESS FOR A PARTICULAR PURPOSE. Please see the CERN OHL v.2 for applicable conditions.
- Contact
- File
- Last Mod.
- Print Date
- Sheet
- Size
- A3
- of
- Rev
- (in symbol ADT7311WTR) °C

### Library data of the parts
C9 C65 = CC0805_20PF_50V_2%_C0G: Non-polarised capacitor; Part Description: SMD Multilayer Chip Ceramic Capacitor; Manufacturer: GENERIC; Manufacturer1 Part Number: CC0805GRNPO9BN200; Voltage: 50V; TC: C0G/NP0; Tolerance: ±2%; Part Number: CC0805_20PF_50V_2%_C0G; Component Kind: Standard; Component Type: Standard; Pin Count: 2; Value: 20pF; Status: None; Manufacturer Part Number: CC0805_20PF_50V_2%_C0G; Case: 0805; Mounted: Yes; Socket: No; SMD: Yes; Sense: No; Manufacturer1 Example: YAGEO PHYCOMP; Manufacturer1 ComponentHeight: 1.45mm; HelpURL: \\cern.ch\dfs\Applications\Altium\Datasheets\CC0805_NP0_YAGEO.pdf; Author: CERN DEM HF; CreateDate: 07.05.2024; LatestRevisionDate: 07.05.2024
C255-C259 = CC0805_220NF_50V_10%_X7R: Non-polarised capacitor; Part Description: SMD Multilayer Chip Ceramic Capacitor; Manufacturer: GENERIC; Manufacturer1 Part Number: GRM21BR71H224KA01L; Voltage: 50V; TC: X7R; Tolerance: ±10%; Part Number: CC0805_220NF_50V_10%_X7R; Component Kind: Standard; Component Type: Standard; Pin Count: 2; Value: 220nF; Status: Preferred; Manufacturer Part Number: CC0805_220NF_50V_10%_X7R; Case: 0805; Mounted: Yes; Socket: No; SMD: Yes; Sense: No; Manufacturer1 Example: MURATA; Manufacturer1 ComponentHeight: 1.35mm; HelpURL: \\cern.ch\dfs\Applications\Altium\Datasheets\CC0805_X7R_MURATA.pdf; Author: CERN DEM JLC; CreateDate: 03.12.2007; LatestRevisionDate: 03.12.2007
D5 = PESD3V3L5UY: Fivefold ESD Protection Diode Arrays; Part Description: Fivefold ESD Protection Diode Arrays (30kV); Manufacturer: NEXPERIA; Voltage: 3.3V; Power: 200W; PressFit: No; Bonding: No; Part Number: PESD3V3L5UY; Component Kind: Standard; Component Type: Standard; Device: PESD3V3L5UY; PackageDescription: SOT363, SC-88, 0.65mm Pitch; 6 Pin, 1.25mm W X 2.00mm L X 1.10mm H body, IPC Medium Density; Manufacturer Part Number: PESD3V3L5UY; Pin Count: 6; Case: SOT363; Mounted: Yes; Socket: No; SMD: Yes; Sense: No; ComponentHeight: 1.1mm; HelpURL: \\cern.ch\dfs\Applications\Altium\Datasheets\PESD3V3L5UY.pdf; Author: CERN DEM WB; CreateDate: 05/07/2021; LatestRevisionDate: 05/07/2021
DA27 = ADT7311WTR: ±0.5°C Accurate, 16-Bit Digital SPI Temperature Sensor; Manufacturer: ANALOG DEVICES; PressFit: No; Bonding: No; Part Number: ADT7311WTR; Component Kind: Standard; Component Type: Standard; Device: ADT7311WTR; PackageDescription: SOIC 8, Pitch 1.27mm - Body 4x5mm, IPC Medium Density; Part Description: ±0.5°C Accurate, 16-Bit Digital SPI Temperature Sensor; Manufacturer Part Number: ADT7311WTR; Pin Count: 8; Case: SOIC8; Mounted: Yes; Socket: No; SMD: Yes; Sense: No; ComponentHeight: 1.75mm; HelpURL: \\cern.ch\dfs\Applications\Altium\Datasheets\ADT7311WTR.pdf; Author: CERN DEM HF; CreateDate: 24.05.2024; LatestRevisionDate: 24.05.2024
DD5 = ATXMEGA128A3U-AU: 8/16-bit XMEGA A3BU 32MHz Microcontroller With 256KBytes of in-System Self-Programmable Flash; Part Description: 8/16-bit XMEGA A3U 32MHz Microcontroller with 128KBytes of in-System Self-Programmable Flash; Manufacturer: MICROCHIP TECHNOLOGY; PressFit: No; Bonding: No; Part Number: ATXMEGA128A3U-AU; Component Kind: Standard; Component Type: Standard; Device: ATXMEGA128A3U-AU; PackageDescription: QFP, 0.80mm Pitch, Square; 64 Pin, 14.00mm L X 14.00mm W X 1.20mm H body, IPC Medium Density; Manufacturer Part Number: ATXMEGA128A3U-AU; Pin Count: 64; Case: QFP64; Mounted: Yes; Socket: No; SMD: Yes; Sense: No; ComponentHeight: 1.2mm; HelpURL: \\cern.ch\dfs\Applications\Altium\Datasheets\ATXMEGA128A3U-AU.pdf; Author: CERN DEM HF; CreateDate: 24.05.2024; LatestRevisionDate: 24.05.2024
J3 = SAMTEC_TSW-104-07-L-S-LL: Connector 4 Male; Part Description: 4 Contacts, Pitch 2.54mm, Single Row  Through Mount Straigh Header (Post Lead 5.84mm, Tail Lead 2.54mm, Insulator 2.54mm); Manufacturer: SAMTEC; PressFit: No; Part Number: SAMTEC_TSW-104-07-L-S-LL; Component Kind: Standard; Component Type: Standard; Pin Count: 4; Family: Header 4; Mounted: Yes; Socket: No; SMD: No; Sense: No; Status: None; Manufacturer Part Number: TSW-104-07-L-S-LL; ComponentHeight: 8.38mm; HelpURL: \\cern.ch\dfs\Applications\Altium\Datasheets\SAMTEC_TSW-104-07-L-S-LL.pdf; Author: CERN DEM MR; CreateDate: 07.12.2016; LatestRevisionDate: 07.12.2016
LD2 = LED_OSRAM_LB Q39G: LED Blue 1C 2A; Part Description: CHIPLED Blue LED (0603 Case); Manufacturer: OSRAM; Manufacturer Part Number: LB Q39G; PressFit: No; Bonding: No; Part Number: LED_OSRAM_LB Q39G; Component Kind: Standard; Component Type: Standard; Color: Blue; PackageDescription: Blue Chip LED, 2-Leads, Body 1.6x0.8mm , IPC Medium Density; Pin Count: 2; Case: 0603; Mounted: Yes; Socket: No; SMD: Yes; Sense: No; ComponentHeight: 0.35mm; HelpURL: \\cern.ch\dfs\Applications\Altium\Datasheets\LED_OSRAM_LB Q39G.pdf; Author: CERN DEM HF; CreateDate: 16.08.2023; LatestRevisionDate: 16.08.2023
LD3 = LED_KINGBRIGHT_KPH-1608CGCK: LED Green 1C 2A; Part Description: SMD Green LED, Case 1.6mmX0.8mm(0603), 0.65mm Thickness; PressFit: No; Bonding: No; Part Number: LED_KINGBRIGHT_KPH-1608CGCK; Component Kind: Standard; Component Type: Standard; Color: Green; PackageDescription: SMT Green LED, Case 0603, Body L 1.6 x W 0.8mm H 0.65mm; Manufacturer: KINGBRIGHT; Manufacturer Part Number: KPH-1608CGCK; Pin Count: 2; Case: 0603; Mounted: Yes; Socket: No; SMD: Yes; Sense: No; ComponentHeight: 0.65mm; HelpURL: \\cern.ch\dfs\Applications\Altium\Datasheets\LED_KINGBRIGHT_KPH-1608CGCK.pdf; Author: CERN DEM JLC; CreateDate: 03.07.2017; LatestRevisionDate: 03.07.2017
R146 R160-R162 = R0603_100R_1%_0.1W_100PPM: as R125 on sheet ADCs; Part Number: R0603_100R_1%_0.1W_100PPM; Component Kind: Standard; Component Type: Standard; Pin Count: 2; Value: 100; Status: Preferred; Manufacturer Part Number: R0603_100R_1%_0.1W_100PPM; Case: 0603; Mounted: Yes; Sense: No; Socket: No; SMD: Yes; Manufacturer1 Example: NIC COMPONENT; Manufacturer1 ComponentHeight: 0.55mm; HelpURL: \\cern.ch\dfs\Applications\Altium\Datasheets\R0603_NIC_NRC.pdf; Author: CERN DEM JLC; CreateDate: 03.12.2007; LatestRevisionDate: 13.03.2008
R151 = R0603_10K_1%_0.1W_100PPM: Resistor - 1%; Part Description: General Purpose Thick Film Chip Resistor; Manufacturer: GENERIC; Manufacturer1 Part Number: NRC06F1002TRF; Power: 0.1W; TC: ±100ppm/°C; PressFit: No; Part Number: R0603_10K_1%_0.1W_100PPM; Component Kind: Standard; Component Type: Standard; Pin Count: 2; Value: 10k; Status: Preferred; Manufacturer Part Number: R0603_10K_1%_0.1W_100PPM; Case: 0603; Mounted: Yes; Sense: No; Socket: No; SMD: Yes; Manufacturer1 Example: NIC COMPONENT; Manufacturer1 ComponentHeight: 0.55mm; HelpURL: \\cern.ch\dfs\Applications\Altium\Datasheets\R0603_NIC_NRC.pdf; Author: CERN DEM JLC; CreateDate: 03.12.2007; LatestRevisionDate: 13.03.2008
VD8 VD13 = LED_KINGBRIGHT_KPT-2012SURCK: LED Red 1C 2A; Part Description: 2.0X1.25mm, SMD Hyper Red Chip LED Lamp, KPT-2012 Series; PressFit: No; Bonding: No; Part Number: LED_KINGBRIGHT_KPT-2012SURCK; Component Kind: Standard; Component Type: Standard; Color: Red; PackageDescription: SMT Hyper Red LED, Case 2012, Body L 2.00mm X  W 1.25mm X H 0.75mm; Manufacturer: KINGBRIGHT; Manufacturer Part Number: KPT-2012SURCK; Pin Count: 2; Case: 0805; Mounted: Yes; Socket: No; SMD: Yes; Sense: No; ComponentHeight: 0.75mm; HelpURL: \\cern.ch\dfs\Applications\Altium\Datasheets\LED_KINGBRIGHT_KPT-2012SURCK.pdf; Author: CERN DEM BC; CreateDate: 06.11.2020; LatestRevisionDate: 06.11.2020
X11 = CONNFLY_DS1013-06SSIB1-B-0: Connector 6 Male; Part Description: 6 Contacts, 2.54mm Box Header V/T,R/A & SMT Type; PressFit: No; Part Number: CONNFLY_DS1013-06SSIB1-B-0; Component Kind: Standard; Component Type: Standard; Pin Count: 6; Mounted: Yes; Socket: No; SMD: No; Sense: No; Status: None; Manufacturer: CONNFLY; Manufacturer Part Number: DS1013-06SSIB1-B-0; ComponentHeight: 9.1mm; HelpURL: \\cern.ch\dfs\Applications\Altium\Datasheets\CONNFLY_DS1013.pdf; Author: CERN DEM HF; CreateDate: 30.05.2024; LatestRevisionDate: 30.05.2024
ZQ1 = XTAL_16MHZ_ABRACON_ABL-16.000MHZ-B1U: Quartz Crystal; Part Description: Tolerance: ±10ppm, Stability: ±10ppm, -20°C to +70°C, 18pF, 40 Ohms ESR, Through Mount Microprocessor Crystal, ABL Series; PressFit: No; Bonding: No; Part Number: XTAL_16MHZ_ABRACON_ABL-16.000MHZ-B1U; Component Kind: Standard; Component Type: Standard; PackageDescription: THD Crystal, Body 11.5mm L X 5.00mm W X 3.50mm H, ALB Series; Value: 16MHz; Manufacturer: ABRACON; Manufacturer Part Number: ABL-16.000MHZ-B1U; Pin Count: 2; Mounted: Yes; Socket: No; SMD: No; Sense: No; ComponentHeight: 3.5mm; HelpURL: \\cern.ch\dfs\Applications\Altium\Datasheets\XTAL_ABRACON_ABL.pdf; Author: CERN DEM HF; CreateDate: 04.06.2024; LatestRevisionDate: 04.06.2024